# Altium schematic sheet ControlRadioClick.SchDoc
size A
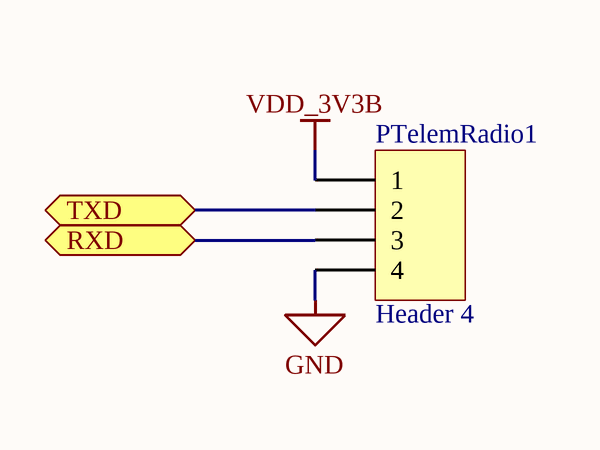
[diagram p0: ControlRadioClick.SchDoc]

## Parts
PTelemRadio1  Header 4  [HDR1X4]

## Ports
RXD, TXD

## Nets
GND: PTelemRadio1.4
VDD_3V3B: PTelemRadio1.1
RXD: PTelemRadio1.3 ; port RXD
TXD: PTelemRadio1.2 ; port TXD

## Library data of the parts
PTelemRadio1 = Header 4: Header, 4-Pin; LatestRevisionDate: 17-Jul-2002; LatestRevisionNote: Re-released for DXP Platform.; Publisher: Altium Limited